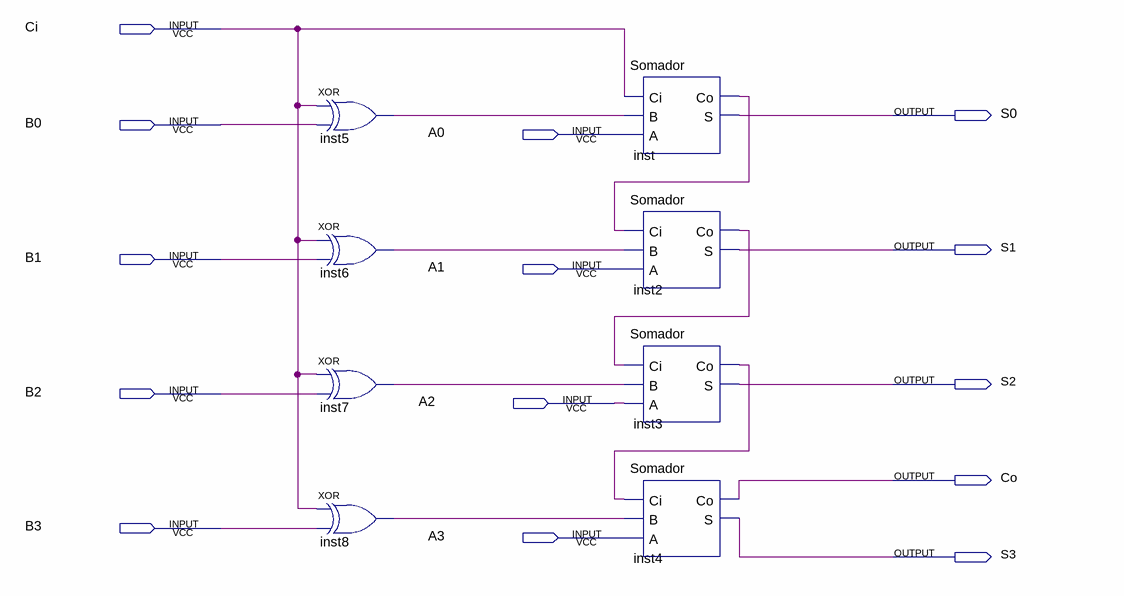
[diagram p0: schematic sheet]
// Quartus schematic Som4Digitos.bdf as structural Verilog: 8 symbols, 14 pins
module Som4Digitos (
  input  Ci,
  input  B0,
  input  A0,
  input  B1,
  input  A1,
  input  B2,
  input  A2,
  input  B3,
  input  A3,
  output S0,
  output S1,
  output S2,
  output Co,
  output S3
);

  wire inst2_co, inst3_co, inst5_out, inst6_out, inst7_out, inst8_out, inst_co;

  xor inst5 (inst5_out, Ci, B0);
  xor inst6 (inst6_out, Ci, B1);
  xor inst7 (inst7_out, Ci, B2);
  xor inst8 (inst8_out, Ci, B3);
  Somador inst (.Ci(Ci), .B(inst5_out), .A(A0), .Co(inst_co), .S(S0));
  Somador inst2 (.Ci(inst_co), .B(inst6_out), .A(A1), .Co(inst2_co), .S(S1));
  Somador inst3 (.Ci(inst2_co), .B(inst7_out), .A(A2), .Co(inst3_co), .S(S2));
  Somador inst4 (.Ci(inst3_co), .B(inst8_out), .A(A3), .Co(Co), .S(S3));
endmodule
